# Altium schematic sheet Power_Connectors.SchDoc
size A4; SheetNumber: 2; SheetTotal: 10
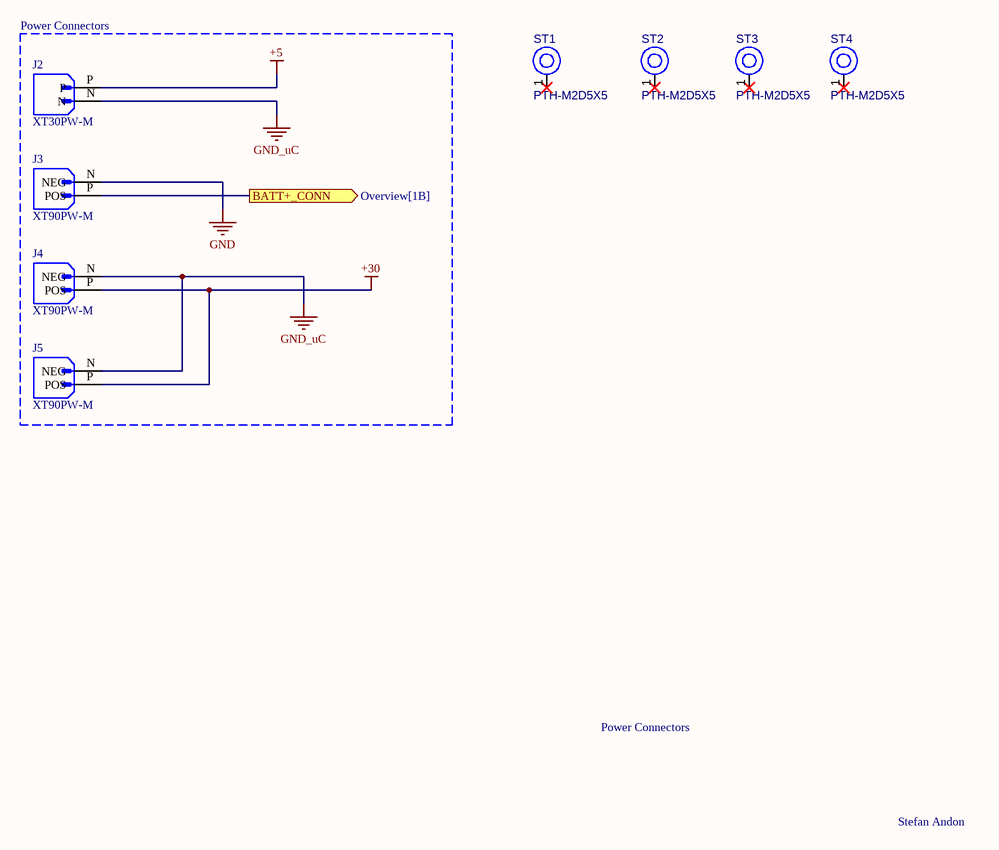
[diagram p0: Power_Connectors.SchDoc]

## Parts
J2  XT30PW-M  [AMASS_XT30PW-M]
J3  XT90PW-M  [AMASS_XT90PW-M]
J4  XT90PW-M  [AMASS_XT90PW-M]
J5  XT90PW-M  [AMASS_XT90PW-M]
ST1  PTH-M2D5X5  [PTH-M2D5X5]
ST2  PTH-M2D5X5  [PTH-M2D5X5]
ST3  PTH-M2D5X5  [PTH-M2D5X5]
ST4  PTH-M2D5X5  [PTH-M2D5X5]

## Blocks framed on the sheet
Power Connectors: J2-J5

## Ports
BATT+_CONN (out, see Overview[1B])

## Nets
+5: J2.P
+30: J4.P(POS) J5.P(POS)
GND: J3.N(NEG)
GND_uC: J2.N J4.N(NEG) J5.N(NEG)
BATT+_CONN: J3.P(POS) ; port BATT+_CONN

Not connected (* = marked no-connect by the designer): ST1 1(H1)*; ST2 1(H1)*; ST3 1(H1)*; ST4 1(H1)*

## Notes on the sheet
- Power Connectors
- Stefan Andon

## Library data of the parts
J2 = CMP-002-00071-1: Socket; DC supply; XT30; male; PIN: 2; on PCBs; THT; Colour: yellow; MF: AMASS; Source: XT30PW-M.SchLib; MP: XT30PW-M; Check_prices: https://www.snapeda.com/parts/XT30PW-M/AMASS/view-part/?ref=eda; Case/Package: None; Pins: 2; Component Type: Standard; Value: *; Design Item ID: XT30PW-M; SnapEDA_Link: https://www.snapeda.com/parts/XT30PW-M/AMASS/view-part/?ref=snap
J3-J5 = CMP-002-00072-1: Socket; DC supply; XT90; male; PIN: 2; on PCBs; THT; Colour: yellow; MF: AMASS; Check_prices: https://www.snapeda.com/parts/XT90PW-M/AMASS/view-part/?ref=eda; MP: XT90PW-M; Case/Package: Package; Pins: 2; SnapEDA_Link: https://www.snapeda.com/parts/XT90PW-M/AMASS/view-part/?ref=snap; Value: *; Source: XT90PW-M.SchLib; Design Item ID: XT90PW-M; Component Type: Standard
ST1-ST4 = CMP-00028-00004-2: M2 PTH (2.5mm), 5mm pad; Pins: 1